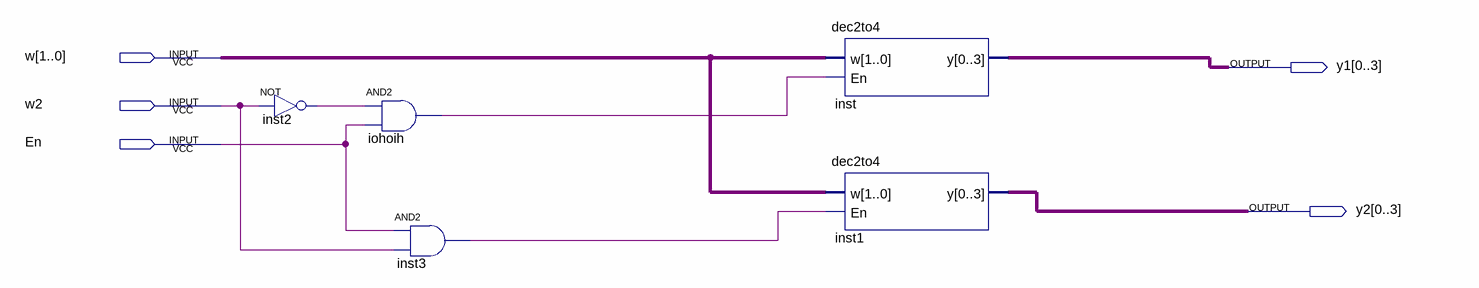
[diagram p0: schematic sheet]
// Quartus schematic decodModified.bdf as structural Verilog: 5 symbols, 5 pins
module decodModified (
  input  [1:0] w,
  input  w2,
  input  En,
  output [0:3] y1,
  output [0:3] y2
);

  wire inst2_out, inst3_out, iohoih_out;

  not inst2 (inst2_out, w2);
  and iohoih (iohoih_out, inst2_out, En);
  and inst3 (inst3_out, En, w2);
  dec2to4 inst (.w(w), .En(iohoih_out), .y(y1));
  dec2to4 inst1 (.w(w), .En(inst3_out), .y(y2));
endmodule
